# Altium project Task 9_1.PrjPcb
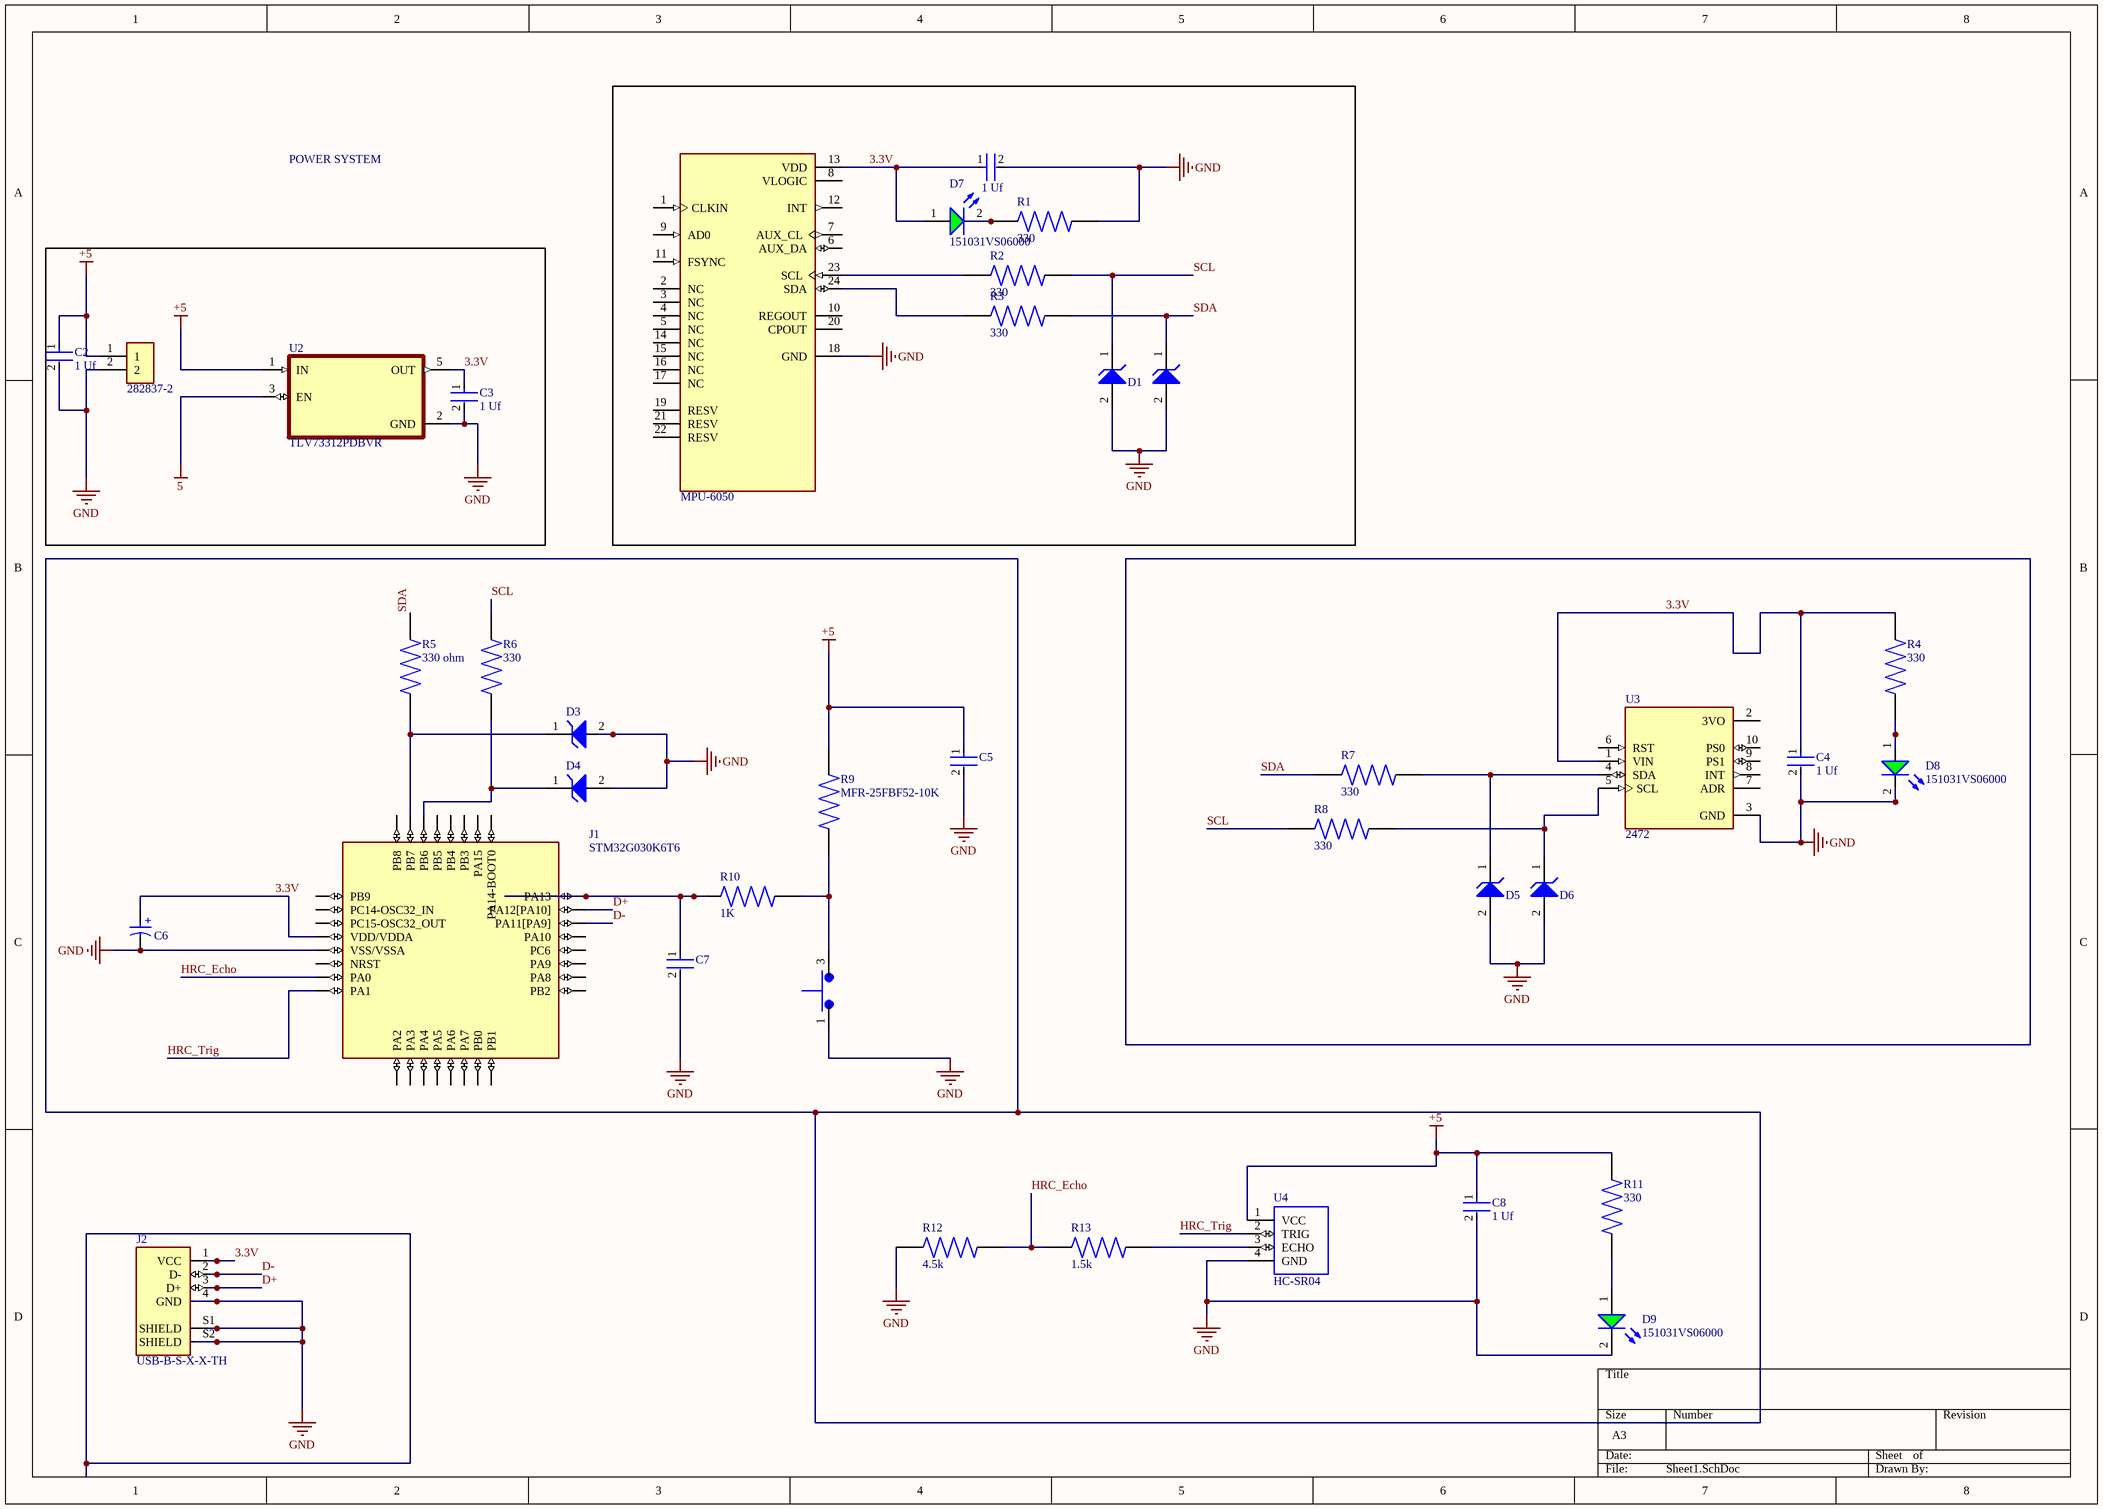
[diagram p0: Sheet1.SchDoc]
1 sheet, 38 parts. Net scope: global (net labels, ports and power ports of the same name join across sheets).
Board file: PCB1.PcbDoc

## Sheet Sheet1.SchDoc
size A3; SheetNumber: 1; SheetTotal: 1

### Parts
(Parts that share a designator on the sheet are numbered #1, #2 ... from top to bottom, then left to right.)
#1  1 Uf  [FP-0402-L_1_0_0_05-W_0_5-MFG]
#2  MPU-6050  [QFN50P400X400X95-24N]
#3  282837-2  [TE_282837-2]
#4  824550781  [WE-TVSP_DO-214AB_Unidirectional]  (value not drawn)
#5  PMS9P1B10M2QE  [SW_PMS9P1B10M2QE]  (value not drawn)
C2  1 Uf  [FP-0402-L_1_0_0_05-W_0_5-MFG]
C3  1 Uf  [FP-0402-L_1_0_0_05-W_0_5-MFG]
C4  1 Uf  [FP-0402-L_1_0_0_05-W_0_5-MFG]
C5  LMK105BJ105KVHF  [FP-0402-L_1_0_0_05-W_0_5-MFG]  (value not drawn)
C6  860040875005  [WCAP-ATUL_D10H25]  (value not drawn)
C7  LMK105BJ105KVHF  [FP-0402-L_1_0_0_05-W_0_5-MFG]  (value not drawn)
C8  1 Uf  [FP-0402-L_1_0_0_05-W_0_5-MFG]
D1  824550781  [WE-TVSP_DO-214AB_Unidirectional]  (value not drawn)
D3  824550781  [WE-TVSP_DO-214AB_Unidirectional]  (value not drawn)
D4  824550781  [WE-TVSP_DO-214AB_Unidirectional]  (value not drawn)
D5  824550781  [WE-TVSP_DO-214AB_Unidirectional]  (value not drawn)
D6  824550781  [WE-TVSP_DO-214AB_Unidirectional]  (value not drawn)
D7  151031VS06000  [WL-TMRC_D3.95H5.3]
D8  151031VS06000  [WL-TMRC_D3.95H5.3]
D9  151031VS06000  [WL-TMRC_D3.95H5.3]
J1  STM32G030K6T6  [QFP32_STM32]
J2  USB-B-S-X-X-TH  [SAMTEC_USB-B-S-X-X-TH]
R1  330  [RESAD1100W55L680D260]
R2  330  [RESAD1100W55L680D260]
R3  330  [RESAD1100W55L680D260]
R4  330  [RESAD1100W55L680D260]
R5  330 ohm  [RESAD1100W55L680D260]
R6  330  [RESAD1100W55L680D260]
R7  330  [RESAD1100W55L680D260]
R8  330  [RESAD1100W55L680D260]
R9  MFR-25FBF52-10K  [RESAD1100W55L680D260]
R10  1K  [RESAD1100W55L680D260]
R11  330  [RESAD1100W55L680D260]
R12  4.5k  [RESAD1100W55L680D260]
R13  1.5k  [RESAD1100W55L680D260]
U2  TLV73312PDBVR  [SOT95P280X145-5N]
U3  2472  [MODULE_2472]
U4  HC-SR04  [XCVR_HC-SR04]

### Nets
5: U2.3(EN)
+5: #3.1 C2.1 C5.1 C8.1 R9.2 R11.2 U2.1(IN) U4.1(VCC)
GND: #1.2 #2.18(GND) #3.2 #4.2(A) #5.1 C2.2 C3.2 C4.2 C5.2 C6.2(N) C7.2 C8.2 D1.2(A) D3.2(A) D4.2(A) D5.2(A) D6.2(A) D8.2(K) D9.2(K) J1.5(VSS/VSSA) J2.4(GND) J2.S1(SHIELD) J2.S2(SHIELD) R1.2 R12.1 U2.2(GND) U3.3(GND) U4.4(GND)
3.3V: #1.1 #2.13(VDD) C3.1 C4.1 C6.1(P) D7.1(A) J1.4(VDD/VDDA) J2.1(VCC) R4.2 U2.5(OUT) U3.1(VIN)
D+: J1.23(PA12[PA10]) J2.3(D+)
D-: J1.22(PA11[PA9]) J2.2(D-)
HRC_Echo: J1.7(PA0) R12.2 R13.1
HRC_Trig: J1.8(PA1) U4.2(TRIG)
SCL: D1.1(K) R2.2 R6.2 R8.1
SDA: #4.1(K) R3.2 R5.2 R7.1
Net#2_23: #2.23(SCL) R2.1
Net#2_24: #2.24(SDA) R3.1
Net#5_3: #5.3 R9.1 R10.2
NetC7_1: C7.1 J1.24(PA13) R10.1
NetD3_1: D3.1(K) J1.31(PB7) R5.1
NetD4_1: D4.1(K) J1.30(PB6) R6.1
NetD5_1: D5.1(K) R7.2 U3.4(SDA)
NetD6_1: D6.1(K) R8.2 U3.5(SCL)
NetD7_2: D7.2(K) R1.1
NetD8_1: D8.1(A) R4.1
NetD9_1: D9.1(A) R11.1
NetR13_2: R13.2 U4.3(ECHO)

Not connected (* = marked no-connect by the designer): #2 1(CLKIN) 2(NC) 3(NC) 4(NC) 5(NC) 6(AUX_DA) 7(AUX_CL) 8(VLOGIC) 9(AD0) 10(REGOUT) 11(FSYNC) 12(INT) 14(NC) 15(NC) 16(NC) 17(NC) 19(RESV) 20(CPOUT) 21(RESV) 22(RESV); J1 1(PB9) 2(PC14-OSC32_IN) 3(PC15-OSC32_OUT) 6(NRST) 9(PA2) 10(PA3) 11(PA4) 12(PA5) 13(PA6) 14(PA7) 15(PB0) 16(PB1) 17(PB2) 18(PA8) 19(PA9) 20(PC6) 21(PA10) 25(PA14-BOOT0) 26(PA15) 27(PB3) 28(PB4) 29(PB5) 32(PB8); U3 2(3VO) 6(RST) 7(ADR) 8(INT) 9(PS1) 10(PS0)

### Notes on the sheet
- POWER SYSTEM
- (in symbol CMP-03913-54202262-1) +

### Library data of the parts
#1 C2-C5 C7 C8 = CMP-14477-000640-2: None; Capacitance: 1uF; Voltage Rating: 10V; Tolerance: 10%
#2 = MPU-6050: MPU-6050 series Accelerometer, Gyroscope, 3 Axis Sensor Evaluation Board; MF: TDK InvenSense
#3 = 282837-2: Ð Ð°Ð·ÑŠÐµÐ¼Ð½Ñ‹Ðµ ÐºÐ»ÐµÐ¼Ð¼Ð½Ñ‹Ðµ ÐºÐ¾Ð»Ð¾Ð´ÐºÐ¸ Ð Ð¾Ð·ÐµÑ‚ÐºÐ° 2 Ð¿Ð¾Ð»Ð¾Ð¶ÐµÐ½Ð¸Ñ 5,08 Ð¼Ð¼ ÐŸÑ€Ð¸Ð¿Ð¾Ð¹ Ð¿Ñ€ÑÐ¼Ð¾Ð¹ Ñ‡ÐµÑ€ÐµÐ· Ð¾Ñ‚Ð²ÐµÑ€ÑÑ‚Ð¸Ðµ 13,5 Ð / ÐºÐ¾Ð½Ñ‚Ð°ÐºÑ‚; MF: TE Connectivity
#4 D1 D3-D6 = CMP-03913-71101749-1: 824550781 TVS diode [Würth Elektronik] 824550781 TVS diode; Reverse Standoff Voltage: 78V; Power Line Protection: No; Peak Pulse Current: 23.8A; Max Breakdown Voltage: 91.25V; Leakage Current: 2µA; Peak Pulse Power: 3kW; Number of Unidirectional Channels: 1; Polarity: Unidirectional; Clamping Voltage: 126V
#5 = PMS9P1B10M2QE: Pushbutton Switch SPST-NO Standard Through Hole; MF: TE Connectivity ALCOSWITCH Switches
C6 = CMP-03913-54202262-1: 860040875005 WCAP-ATUL Aluminum Electrolytic Capacitors; Impedance: 200mΩ; Ripple Current: 800mA; Leakage Current: 100µA; Voltage Rating (DC): 100V; Life (Hours): 7000hours; Tolerance: 20%; Pitch: 5mm; Polarity: Polar; Capacitance: 100µF; Max Operating Temperature: 105°C; Diameter: 10mm; Height - Seated (Max): 26.4922mm; Min Operating Temperature: -40°C; Height: 25mm; Mount: Through Hole; Case/Package: Radial; REACH SVHC: Unknown; Lead Pitch: 5.0038mm; Voltage Rating: 100V; NexarPartId: 54202262; Packaging: Tape & Box (TB); RoHS: Compliant; Length: 25mm
D7-D9 = CMP-1488-00004-2: NexarPartId: 29717805; Peak Wavelength: 560nm; Lens Style: Circular, Diffused, Round; Forward Voltage: 2.2V; Lens Size: 3mm; Wavelength: 568nm; Test Current: 20mA; Max Reverse Voltage (DC): 5V; Color: Green; Forward Current: 100mA; Viewing Angle: 60°; Luminous Intensity: 30mcd; Case/Package: Radial; RoHS: Compliant; Packaging: Bulk; Max Operating Temperature: 85°C; Lead Free: Lead Free; Min Operating Temperature: -40°C; Length: 3mm; Width: 3mm; REACH SVHC: Unknown; Mount: Through Hole; Height: 5.3mm; Dominant Wavelength: 568nm
J1 = STM32G030K6T6: ARMÂ® CortexÂ®-M0+ STM32G0 Microcontroller IC 32-Bit Single-Core 64MHz 32KB (32K x 8) FLASH 32-LQFP (7x7); MF: STMicroelectronics; SnapEDA_Link: https://www.snapeda.com/parts/STM32G030K6T6/STMicroelectronics/view-part/?ref=snap; Package: LQFP-32 STMicroelectronics; Value: *; MP: STM32G030K6T6; Check_prices: https://www.snapeda.com/parts/STM32G030K6T6/STMicroelectronics/view-part/?ref=eda
J2 = USB-B-S-X-X-TH: USB-B (USB TYPE-B) USB 2.0 Receptacle Connector 4 Position Through Hole, Right Angle; MF: Samtec; MP: USB-B-S-F-W-TH-TR; SnapEDA_Link: https://www.snapeda.com/parts/USB-B-S-F-W-TH-TR/Samtec/view-part/?ref=snap; Package: None; Value: *; Check_prices: https://www.snapeda.com/parts/USB-B-S-F-W-TH-TR/Samtec/view-part/?ref=eda
R1-R11 = MFR-25FBF52-10K: 10.2 kOhms Â±1% 0.25W, 1/4W Through Hole Resistor Axial - Metal Film; MF: Yageo; SnapEDA_Link: https://www.snapeda.com/parts/MFR-25FBF52-10K/Yageo/view-part/?ref=snap; Package: RADIAL-2 YAGEO; Value: *; MP: MFR-25FBF52-10K; Check_prices: https://www.snapeda.com/parts/MFR-25FBF52-10K/Yageo/view-part/?ref=eda
R12 = MFR-25FBF52-10K: 4.5; MF: Yageo; SnapEDA_Link: https://www.snapeda.com/parts/MFR-25FBF52-10K/Yageo/view-part/?ref=snap; Package: RADIAL-2 YAGEO; Value: *; MP: MFR-25FBF52-10K; Check_prices: https://www.snapeda.com/parts/MFR-25FBF52-10K/Yageo/view-part/?ref=eda
R13 = MFR-25FBF52-10K: MF: Yageo; SnapEDA_Link: https://www.snapeda.com/parts/MFR-25FBF52-10K/Yageo/view-part/?ref=snap; Package: RADIAL-2 YAGEO; Value: *; MP: MFR-25FBF52-10K; Check_prices: https://www.snapeda.com/parts/MFR-25FBF52-10K/Yageo/view-part/?ref=eda
U2 = TLV73312PDBVR: 300-mA, capacitor-free, low-IQ, low-dropout voltage regulator with enable; MF: Texas Instruments; SnapEDA_Link: https://www.snapeda.com/parts/TLV73312PDBVR/Texas+Instruments/view-part/?ref=snap; Package: SOT-23-5 Texas Instruments; Value: *; MP: TLV73312PDBVR; Check_prices: https://www.snapeda.com/parts/TLV73312PDBVR/Texas+Instruments/view-part/?ref=eda
U3 = 2472: Adafruit 9-DOF Absolute Orientation IMU Fusion Breakout - BNO055 | Adafruit Industries 2472; SnapEDA_Link: https://www.snapeda.com/parts/2472/Adafruit+Industries/view-part/?ref=snap; Package: Non-Standard Adafruit; Value: *; MF: Adafruit; MP: 2472; Check_prices: https://www.snapeda.com/parts/2472/Adafruit+Industries/view-part/?ref=eda
U4 = HC-SR04: Ultrasonic Sensor Module; Availability: Unavailable; MP: HC-SR04; Value: *; Price: None; Package: None